# Altium project DS130-1.01-B G-M传感器.PrjPcb
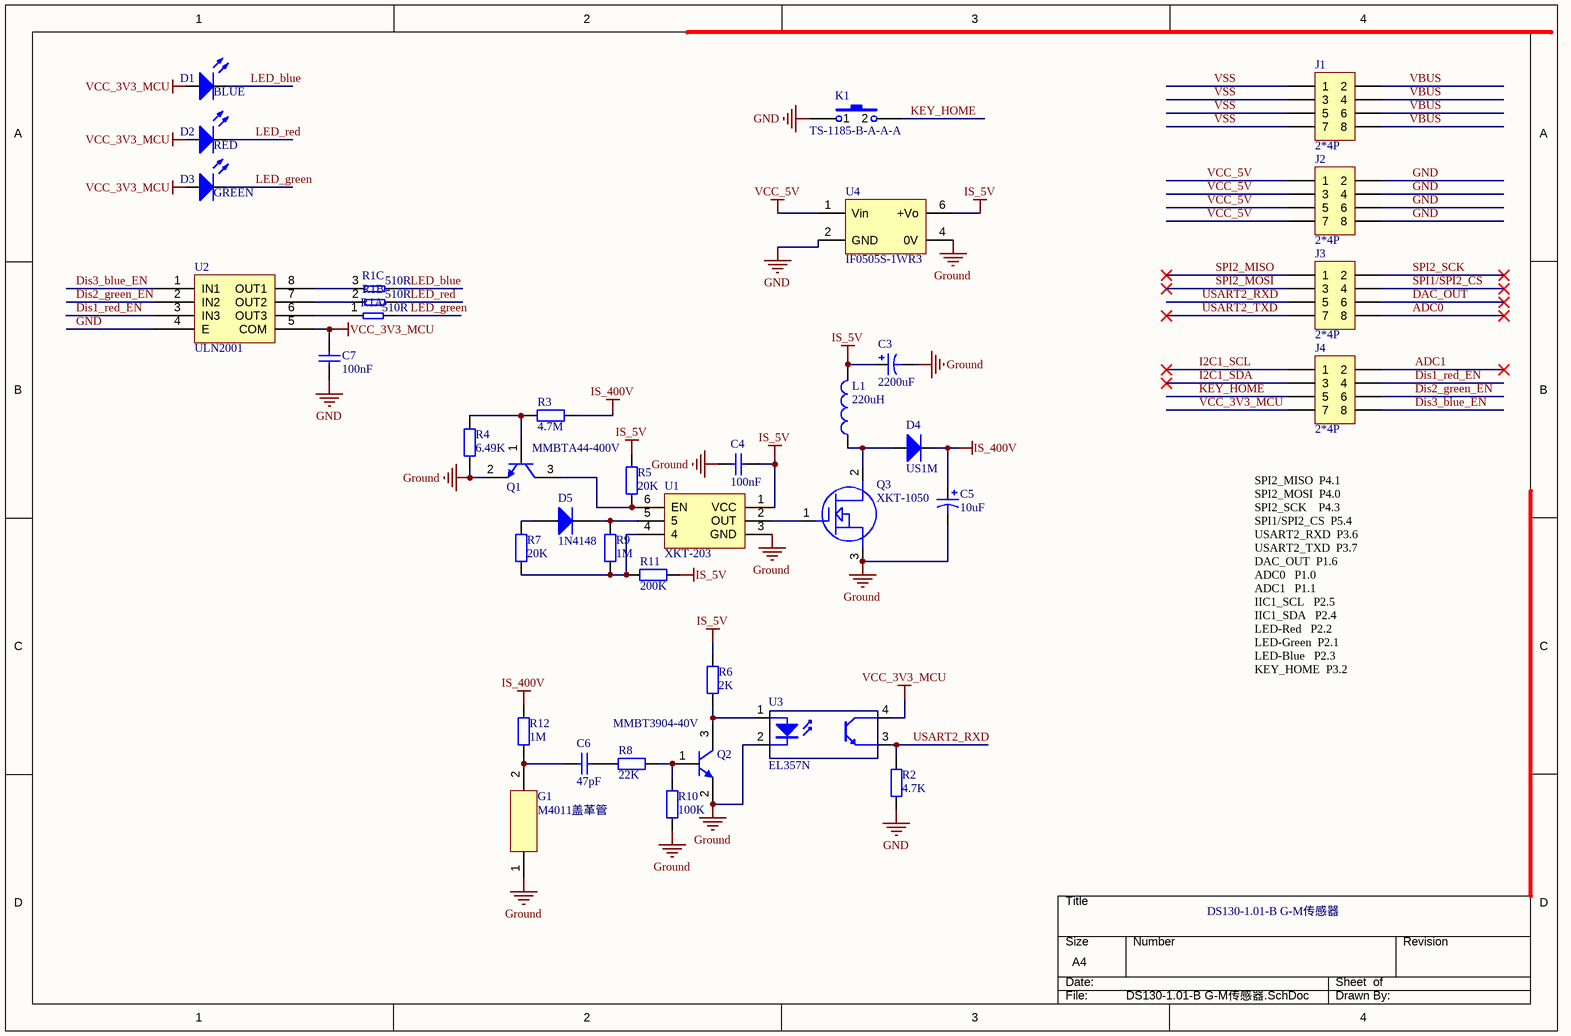
[diagram p0: DS130-1.01-B G-M传感器.SchDoc]
1 sheet, 36 parts. Net scope: global (net labels, ports and power ports of the same name join across sheets).
Board file: DS130-1.01-B G-M传感器.PcbDoc

## Sheet DS130-1.01-B G-M传感器.SchDoc
size A4; SheetNumber: 1; SheetTotal: 1

### Parts
C3  value 2200uF  [E-Cap_Ф12.5mm_5mm_DIP]  (hidden comment: E-Cap_2200uF/25V ±20％ 13*21mm DIP2)
C4  value 100nF  [0603CAP]  (hidden comment: SMDCAP00013)
C5  value 10uF  [E-Cap_Ф10mm_5mm_16mm_DIP]  (hidden comment: E-Cap_10uF/450V ±20％ 4*7mm DIP2)
C6  value 47pF  [1206CAP]  (hidden comment: MLCC 47pF 1kV ±5％ 1206)
C7  value 100nF  [0603CAP]  (hidden comment: SMDCAP00013)
D1  value BLUE  [LED_0805]  (hidden comment: SMDLED00010)
D2  value RED  [LED_0805]  (hidden comment: SMDLED00003)
D3  value GREEN  [LED_0805]  (hidden comment: Chip 翠绿LED 0805)
D4  value US1M  [SMA/DO-214AC]  (hidden comment: US1M-DO-214AC)
D5  value 1N4148  [SOD-123]  (hidden comment: DIPDIODE02001)
G1  M4011盖革管  [M4011-90]
J1  value 2*4P  [X1321WVS-2x04J-C40D53]  (hidden comment: X1321WVS-2x04J-C40D53)
J2  value 2*4P  [X1321WVS-2x04J-C40D53]  (hidden comment: X1321WVS-2x04J-C40D53)
J3  value 2*4P  [X1321WVS-2x04J-C40D53]  (hidden comment: X1321WVS-2x04J-C40D53)
J4  value 2*4P  [X1321WVS-2x04J-C40D53]  (hidden comment: X1321WVS-2x04J-C40D53)
K1  TS-1185-B-A-A-A  [KEY_TS-1185-x-A-A-A]
L1  value 220uH  [IND-SMD_L8.0-W8.0]  (hidden comment: SMD_220uH 8.0*8.0)
Q1  value MMBTA44-400V  [SOT23]  (hidden comment: MMBTA44)
Q2  value MMBT3904-40V  [SOT23]  (hidden comment: MMBT3904)
Q3  XKT-1050  [TO-252]
R1  value 510R  [0603RES_Pack4]  (hidden comment: SMDRES05003)  (parts A,B,C of 4)
R2  value 4.7K  [0603RES]  (hidden comment: Chip 4.7K 1/16W ±1％ 0603)
R3  value 4.7M  [1206RES]  (hidden comment: Chip 4.7M 1/4W ±1％ 1206 500V)
R4  value 6.49K  [0603RES]  (hidden comment: Chip 6.49K 1/8W ±1％ 0603)
R5  value 20K  [0603RES]  (hidden comment: SMDRES00058)
R6  value 2K  [0603RES]  (hidden comment: SMDRES00042)
R7  value 20K  [0603RES]  (hidden comment: SMDRES00058)
R8  value 22K  [0603RES]  (hidden comment: SMDRES00108)
R9  value 1M  [0603RES]  (hidden comment: SMDRES00085)
R10  value 100K  [0603RES]  (hidden comment: SMDRES00071)
R11  value 200K  [0603RES]  (hidden comment: SMDRES00075)
R12  value 1M  [0805RES]  (hidden comment: Chip 1M 1/10W ±1％ 0805 400V)
U1  XKT-203  [SOT23-6]
U2  value ULN2001  [SO-8]  (hidden comment: SMDIC000018)
U3  EL357N  [SO-4]
U4  IF0505S-1WR3  [IF0505S-1WR3]

### Nets
GND: C7.2 J2.2 J2.4 J2.6 J2.8 K1.1 R2.1 U2.4(E) U4.2(GND)
Ground: C3.2 C4.1 C5.2 G1.1 Q1.2(E) Q2.2(E) Q3.3(S) R4.1 R10.1 U1.3(GND) U3.2(K) U4.4(0V)
IS_5V: C3.1 C4.2 L1.2 R5.2 R6.2 R11.1 U1.1(VCC) U4.6(+Vo)
IS_400V: C5.1 D4.2(K) R3.2 R12.2
VCC_3V3_MCU: C7.1 D1.1(A) D2.1(A) D3.1(A) J4.7 U2.5(COM) U3.4(C)
VCC_5V: J2.1 J2.3 J2.5 J2.7 U4.1(Vin)
ADC0: J3.8
ADC1: J4.2
DAC_OUT: J3.6
Dis1_red_EN: J4.4 U2.3(IN3)
Dis2_green_EN: J4.6 U2.2(IN2)
Dis3_blue_EN: J4.8 U2.1(IN1)
I2C1_SCL: J4.1
I2C1_SDA: J4.3
KEY_HOME: J4.5 K1.2
LED_blue: D1.2(K) R1.6
LED_green: D3.2(K) R1.8
LED_red: D2.2(K) R1.7
SPI1/SPI2_CS: J3.4
SPI2_MISO: J3.1
SPI2_MOSI: J3.3
SPI2_SCK: J3.2
USART2_RXD: J3.5 R2.2 U3.3(E)
USART2_TXD: J3.7
VBUS: J1.2 J1.4 J1.6 J1.8
VSS: J1.1 J1.3 J1.5 J1.7
NetC6_1: C6.1 G1.2 R12.1
NetC6_2: C6.2 R8.1
NetD4_1: D4.1(A) L1.1 Q3.2(D)
NetD5_1: D5.1(A) R7.2
NetD5_2: D5.2(K) R9.2 U1.5
NetQ1_1: Q1.1(B) R3.1 R4.2
NetQ1_3: Q1.3(C) R5.1 U1.6(EN)
NetQ2_1: Q2.1(B) R8.2 R10.2
NetQ2_3: Q2.3(C) R6.1 U3.1(A)
NetQ3_1: Q3.1(G) U1.2(OUT)
NetR1_1: R1.1 U2.6(OUT3)
NetR1_2: R1.2 U2.7(OUT2)
NetR1_3: R1.3 U2.8(OUT1)
NetR7_1: R7.1 R9.1 R11.2 U1.4

### Notes on the sheet
- SPI2_MISO		P4.1
  SPI2_MOSI		P4.0
  SPI2_SCK 			P4.3
  SPI1/SPI2_CS		P5.4
  USART2_RXD		P3.6
  USART2_TXD		P3.7
  DAC_OUT		P1.6
  ADC0			P1.0
  ADC1			P1.1
  IIC1_SCL			P2.5
  IIC1_SDA			P2.4
  LED-Red			P2.2
  LED-Green		P2.1
  LED-Blue			P2.3
  KEY_HOME		P3.2
- DS130-1.01-B G-M传感器
- DWG. NO.
- REV.
- SHT.
- THIS DOCUMENT AND THE DATA DISCLOSED HEREIN OR HEREWITH IS THE PROPERTY OF ALTIUM LIMITED AND MAY BE FREELY DISTRIBUTED IN WHOLE. NO RIGHTS ARE RESERVED OR EXPRESS OR IMPLIED WARANTEE GIVEN.
- REVISION
- DESCRIPTION
- DATE
- APPROVED
- ENG:
- APPROVALS
- PROJECT
- DSN:
- CHK:
- REFERENCE DOCUMENTS
- PROJECT REVISION:
- TITLE
- DOCUMENT REVISION:
- DESIGN ITEM:
- BOM:
- FAB DWG:
- PCB DWG:
- ASSY DWG:
- SCALE:
- SIZE
- B
- CAGE CODE
- FILE NAME
- DWG NO.
- SHEET
- OF
- REV

### Library data of the parts
C3 = E-Cap_2200uF/25V ±20％ 13*21mm DIP2: 插件铝电解电容
C4 C7 = MLCC 100nF 50V ±10％ 0603: 贴片电容
C5 = E-Cap_10uF/450V ±20％ 4*7mm DIP2: 插件铝电解电容
C6 = MLCC 47pF 1kV ±5％ 1206: 贴片电容
D1 = Chip 蓝色LED 0805: 贴片LED
D2 = Chip 红色LED 0805: 贴片LED
D3 = Chip 翠绿LED 0805: 贴片LED
D4 = US1M-DO-214AC: 快恢复/高效率二极管
D5 = 1N4148W: 贴片开关二极管 T4
J1-J4 = X1321WVS-2x04J-C40D53: 双排针2x4P 立贴 1.27mm
K1 = TS-1185-B-A-A-A: 轻触开关; Value: TS-1185-B-A-A-A
Q1 = MMBTA44: BJT
Q2 = MMBT3904: BJT
Q3 = XKT-1050: NMOS; Value: XKT-1050
R1 = Chip R*4 510R 1/16W ±5％ 0603: 贴片排阻
R2 = Chip 4.7K 1/16W ±1％ 0603: 贴片电阻
R3 = Chip 4.7M 1/4W ±1％ 1206 500V: 贴片电阻
R4 = Chip 6.49K 1/8W ±1％ 0603: 贴片电阻
R5 R7 = Chip 20K 1/16W ±1％ 0603: 贴片电阻
R6 = Chip 2K 1/16W ±1％ 0603: 贴片电阻
R8 = Chip 22K 1/16W ±1％ 0603: 贴片电阻
R9 = Chip 1M 1/16W ±1％ 0603: 贴片电阻
R10 = Chip 100K 1/16W ±1％ 0603: 贴片电阻
R11 = Chip 200K 1/16W ±1％ 0603: 贴片电阻
R12 = Chip 1M 1/10W ±1％ 0805 400V: 贴片电阻
U2 = ULN2001 SOP-8: 电机驱动芯片
U3 = EL357N: 光耦; Value: EL357N
G1 = M4011盖革管: Value: M4011盖革管
U1 = XKT-203: Value: XKT-203